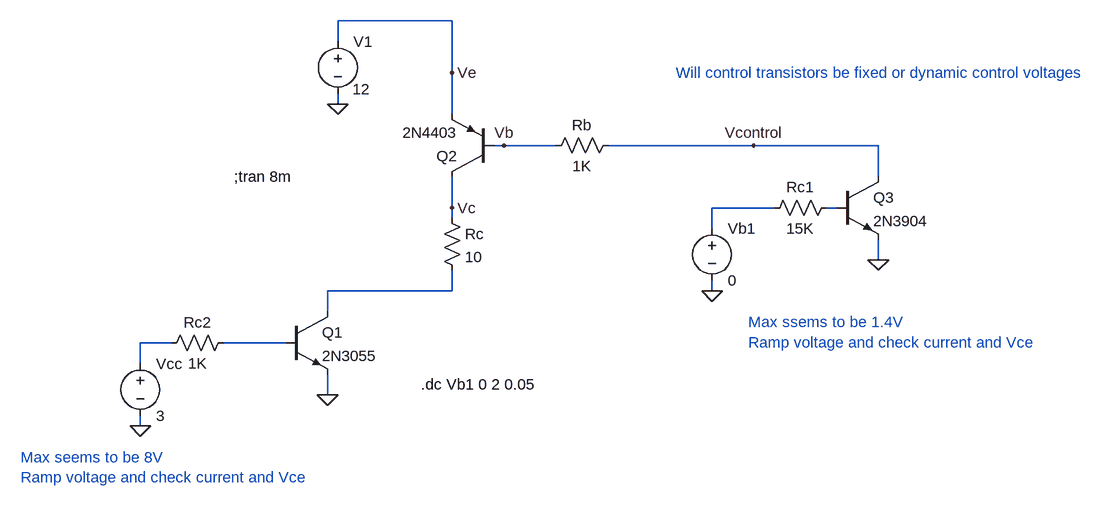
[diagram p0: schematic PNP Configuration - Vbe Testing.asc]
PNP Configuration - Vbe Testing.asc, the LTspice schematic file:
Version 4
SHEET 1 1576 804
WIRE 96 0 -80 0
WIRE -80 32 -80 0
WIRE 96 80 96 0
WIRE -80 128 -80 112
WIRE 96 144 96 80
WIRE 176 192 160 192
WIRE 256 192 176 192
WIRE 560 192 336 192
WIRE 752 192 560 192
WIRE 752 240 752 192
WIRE 96 288 96 240
WIRE 592 288 496 288
WIRE 688 288 672 288
WIRE 96 304 96 288
WIRE 496 320 496 288
WIRE 752 368 752 336
WIRE 96 416 96 384
WIRE 96 416 -96 416
WIRE 496 416 496 400
WIRE -96 448 -96 416
WIRE -336 496 -384 496
WIRE -160 496 -256 496
WIRE -384 528 -384 496
WIRE -96 576 -96 544
WIRE -384 624 -384 608
FLAG -80 128 0
FLAG 96 80 Ve
FLAG 96 288 Vc
FLAG 176 192 Vb
FLAG -96 576 0
FLAG -384 624 0
FLAG 752 368 0
FLAG 496 416 0
FLAG 560 192 Vcontrol
SYMBOL pnp 160 240 R180
SYMATTR InstName Q2
SYMATTR Value 2N4403
SYMBOL res 352 176 R90
WINDOW 0 0 56 VBottom 2
WINDOW 3 32 56 VTop 2
SYMATTR InstName Rb
SYMATTR Value 1K
SYMBOL res 80 288 R0
SYMATTR InstName Rc
SYMATTR Value 10
SYMBOL res -240 480 R90
WINDOW 0 0 56 VBottom 2
WINDOW 3 32 56 VTop 2
SYMATTR InstName Rc2
SYMATTR Value 1K
SYMBOL voltage -80 16 R0
WINDOW 123 0 0 Left 2
WINDOW 39 0 0 Left 2
WINDOW 3 23 89 Left 2
SYMATTR Value 12
SYMATTR InstName V1
SYMBOL npn 688 240 R0
SYMATTR InstName Q3
SYMATTR Value 2N3904
SYMBOL res 688 272 R90
WINDOW 0 0 56 VBottom 2
WINDOW 3 32 56 VTop 2
SYMATTR InstName Rc1
SYMATTR Value 15K
SYMBOL voltage -384 512 R0
WINDOW 123 0 0 Left 2
WINDOW 39 0 0 Left 2
SYMATTR InstName Vcc
SYMATTR Value 3
SYMBOL voltage 496 304 R0
WINDOW 123 0 0 Left 2
WINDOW 39 0 0 Left 2
SYMATTR InstName Vb1
SYMATTR Value 0
SYMBOL npn -160 448 R0
SYMATTR InstName Q1
SYMATTR Value 2N3055
TEXT -240 240 Left 2 !;tran 8m
TEXT 552 464 Left 2 ;Max ssems to be 1.4V\nRamp voltage and check current and Vce
TEXT -568 672 Left 2 ;Max seems to be 8V\nRamp voltage and check current and Vce
TEXT 440 80 Left 2 ;Will control transistors be fixed or dynamic control voltages
TEXT 48 560 Left 2 !.dc Vb1 0 2 0.05

The netlist it stands for:
* PNP Configuration - Vbe Testing.asc
Q2 Vc Vb Ve 0 2N4403
Rb Vcontrol Vb 1K
Rc Vc N003 10
Rc2 N005 N004 1K
V1 Ve 0 12
Q3 Vcontrol N002 0 0 2N3904
Rc1 N002 N001 15K
Vcc N004 0 3
Vb1 N001 0 0
Q1 N003 N005 0 0 2N3055
.model NPN NPN
.model PNP PNP
.lib standard.bjt
;tran 8m
* Max ssems to be 1.4V
* Ramp voltage and check current and Vce
* Max seems to be 8V
* Ramp voltage and check current and Vce
* Will control transistors be fixed or dynamic control voltages
.dc Vb1 0 2 0.05
.backanno
.end